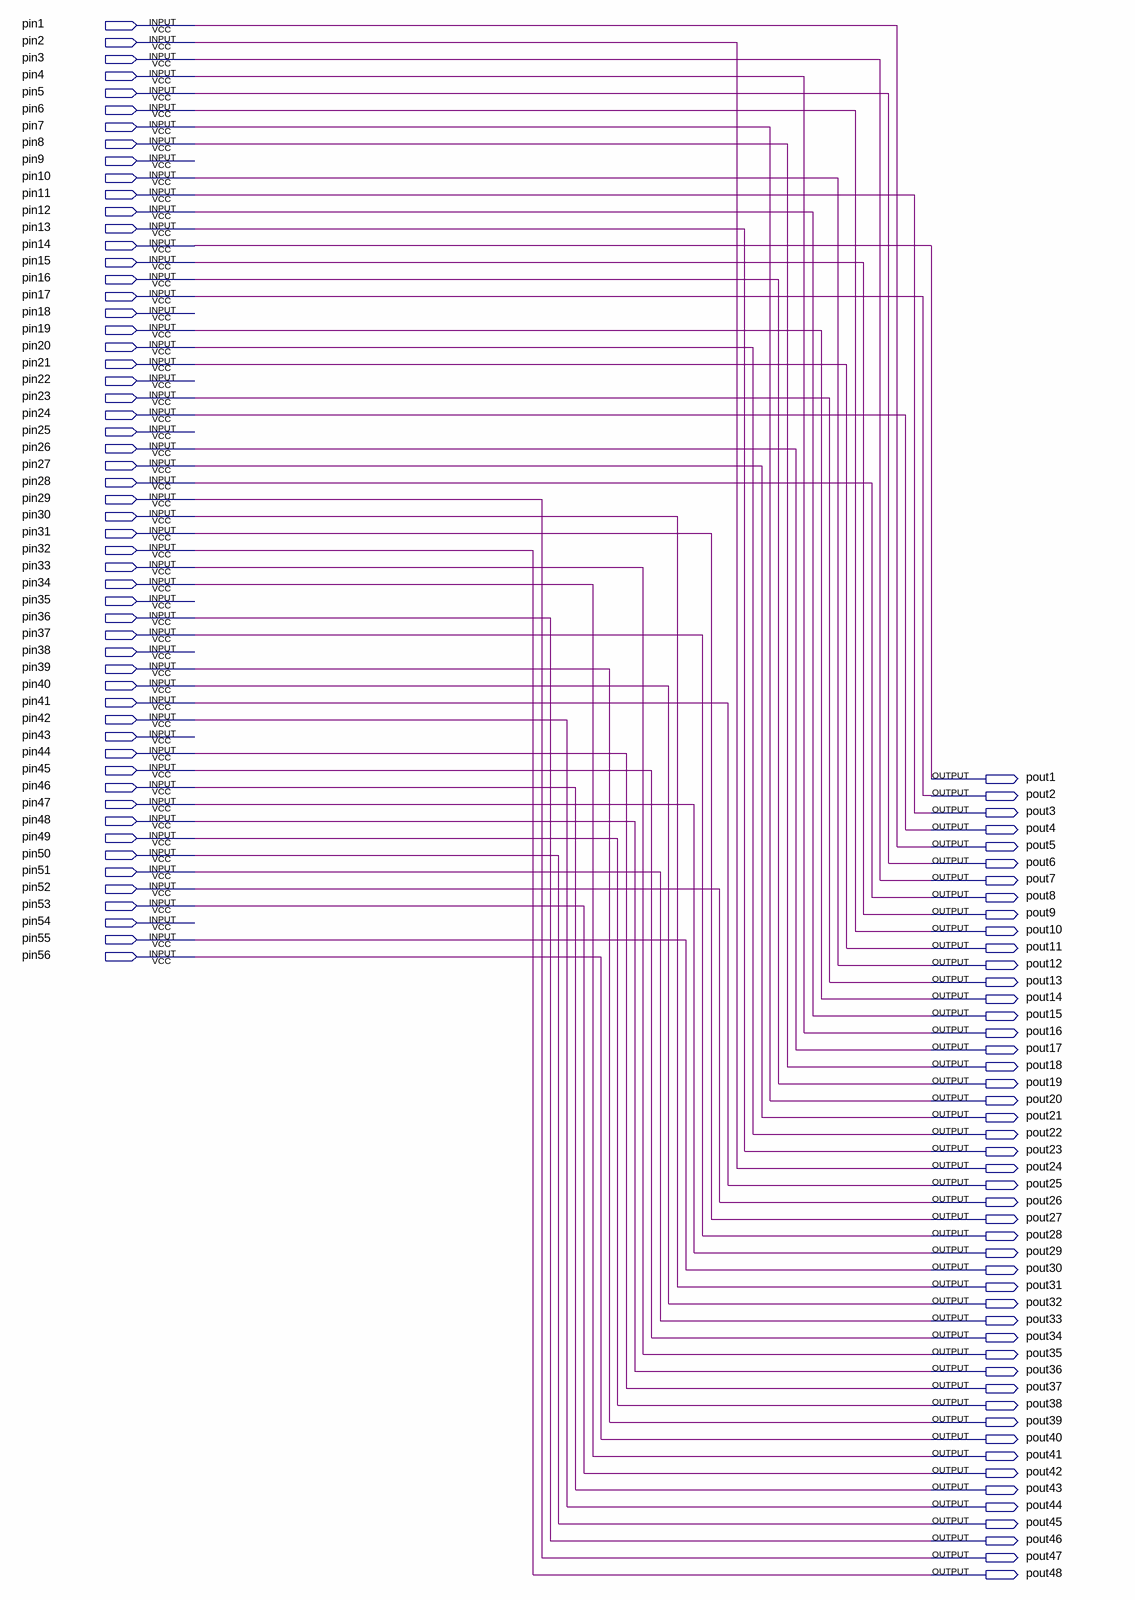
[diagram p0: schematic sheet]
// Quartus schematic PC_2.bdf as structural Verilog: 0 symbols, 104 pins
module PC_2 (
  input  pin1,
  input  pin2,
  input  pin3,
  input  pin4,
  input  pin5,
  input  pin6,
  input  pin7,
  input  pin8,
  input  pin9,
  input  pin10,
  input  pin11,
  input  pin12,
  input  pin13,
  input  pin14,
  input  pin15,
  input  pin16,
  input  pin17,
  input  pin18,
  input  pin19,
  input  pin20,
  input  pin21,
  input  pin22,
  input  pin23,
  input  pin24,
  input  pin25,
  input  pin26,
  input  pin27,
  input  pin28,
  input  pin29,
  input  pin30,
  input  pin31,
  input  pin32,
  input  pin33,
  input  pin34,
  input  pin35,
  input  pin36,
  input  pin37,
  input  pin38,
  input  pin39,
  input  pin40,
  input  pin41,
  input  pin42,
  input  pin43,
  input  pin44,
  input  pin45,
  input  pin46,
  input  pin47,
  input  pin48,
  input  pin49,
  input  pin50,
  input  pin51,
  input  pin52,
  input  pin53,
  input  pin54,
  input  pin55,
  input  pin56,
  output pout1,
  output pout2,
  output pout3,
  output pout4,
  output pout5,
  output pout6,
  output pout7,
  output pout8,
  output pout9,
  output pout10,
  output pout11,
  output pout12,
  output pout13,
  output pout14,
  output pout15,
  output pout16,
  output pout17,
  output pout18,
  output pout19,
  output pout20,
  output pout21,
  output pout22,
  output pout23,
  output pout24,
  output pout25,
  output pout26,
  output pout27,
  output pout28,
  output pout29,
  output pout30,
  output pout31,
  output pout32,
  output pout33,
  output pout34,
  output pout35,
  output pout36,
  output pout37,
  output pout38,
  output pout39,
  output pout40,
  output pout41,
  output pout42,
  output pout43,
  output pout44,
  output pout45,
  output pout46,
  output pout47,
  output pout48
);


  assign pout1 = pin14;
  assign pout2 = pin17;
  assign pout3 = pin11;
  assign pout4 = pin24;
  assign pout5 = pin1;
  assign pout6 = pin5;
  assign pout7 = pin3;
  assign pout8 = pin28;
  assign pout9 = pin15;
  assign pout10 = pin6;
  assign pout11 = pin21;
  assign pout12 = pin10;
  assign pout13 = pin23;
  assign pout14 = pin19;
  assign pout15 = pin12;
  assign pout16 = pin4;
  assign pout17 = pin26;
  assign pout18 = pin8;
  assign pout19 = pin16;
  assign pout20 = pin7;
  assign pout21 = pin27;
  assign pout22 = pin20;
  assign pout23 = pin13;
  assign pout24 = pin2;
  assign pout25 = pin41;
  assign pout26 = pin52;
  assign pout27 = pin31;
  assign pout28 = pin37;
  assign pout29 = pin47;
  assign pout30 = pin55;
  assign pout31 = pin30;
  assign pout32 = pin40;
  assign pout33 = pin51;
  assign pout34 = pin45;
  assign pout35 = pin33;
  assign pout36 = pin48;
  assign pout37 = pin44;
  assign pout38 = pin49;
  assign pout39 = pin39;
  assign pout40 = pin56;
  assign pout41 = pin34;
  assign pout42 = pin53;
  assign pout43 = pin46;
  assign pout44 = pin42;
  assign pout45 = pin50;
  assign pout46 = pin36;
  assign pout47 = pin29;
  assign pout48 = pin32;
endmodule
